# Altium project AlarmClock.PrjPcb
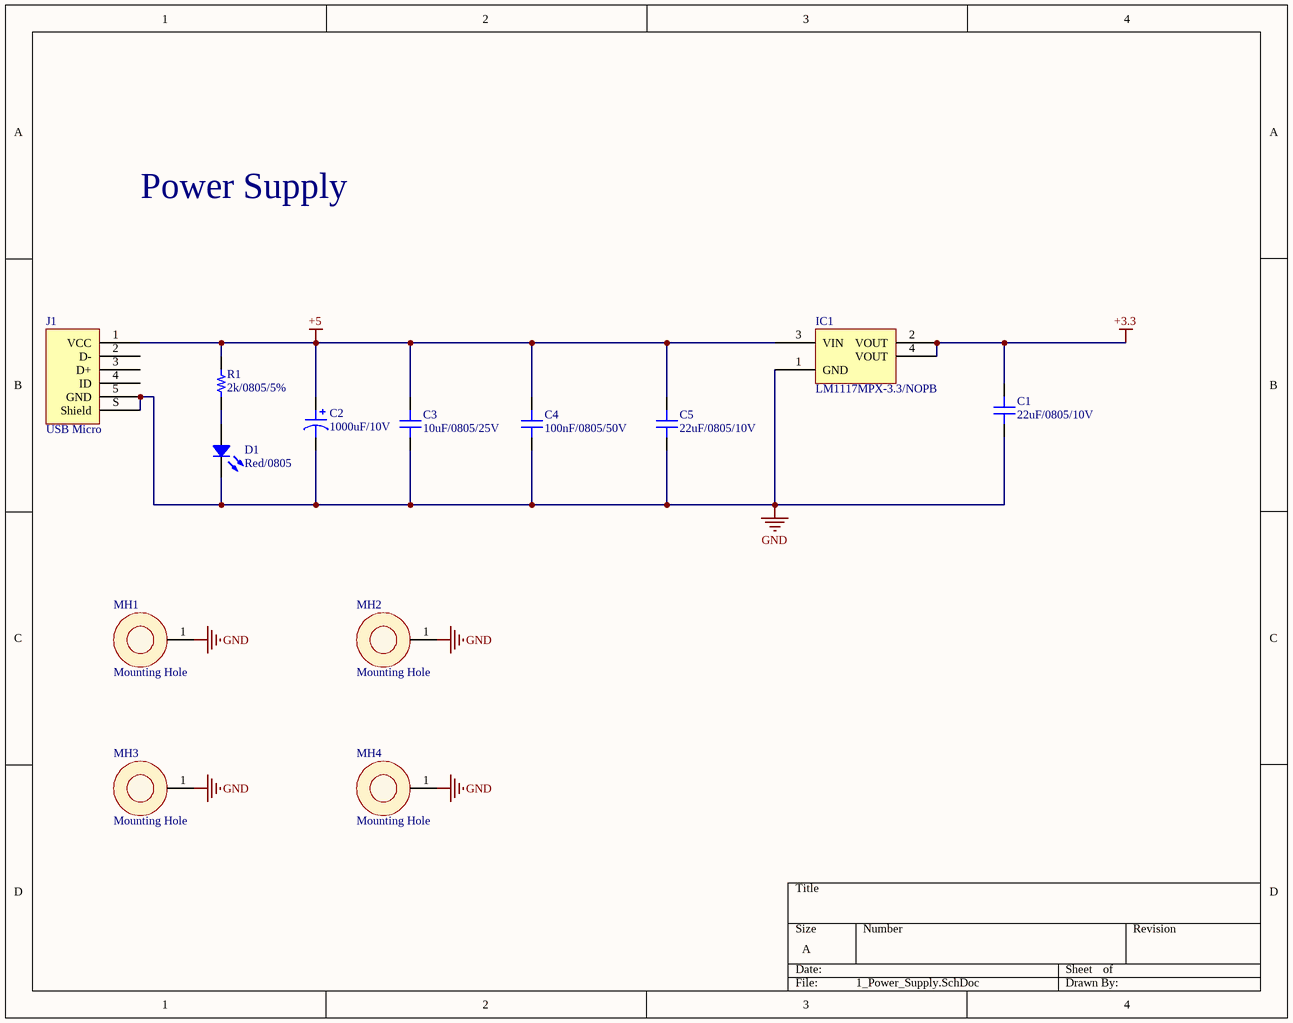
[diagram p0: 1_Power_Supply.SchDoc]
5 sheets, 80 parts. Net scope: flat (ports and power ports of the same name join across sheets).
Board file: PCB1.PcbDoc
Sheets:
  1_Power_Supply.SchDoc
  2_DS3231.SchDoc
  3_IO_Module.SchDoc
  4_MCU.SchDoc
  5_LCD.SchDoc

## Sheet 1_Power_Supply.SchDoc
size A; SheetNumber: 1; SheetTotal: 5

### Parts
C1  22uF/0805/10V  [CAP 0805_2012]
C2  1000uF/10V  [CAP ALSMD 4.3MM H5.4MM]
C3  10uF/0805/25V  [CAP FILM 0805]
C4  100nF/0805/50V  [CAP FILM 0805]
C5  22uF/0805/10V  [CAP 0805_2012]
D1  Red/0805  [LED 0805_2012 RED]
IC1  LM1117MPX-3.3/NOPB  [TI SOT-223 DCY]
J1  USB Micro  [FCI USB 10118193-0001LF]
MH1  Mounting Hole  [M3_Hole]  (no BOM)
MH2  Mounting Hole  [M3_Hole]  (no BOM)
MH3  Mounting Hole  [M3_Hole]  (no BOM)
MH4  Mounting Hole  [M3_Hole]  (no BOM)
R1  2k/0805/5%  [RES 0805_2012]

### Nets
+3.3: C1.1 IC1.2(VOUT) IC1.4(VOUT)
+5: C2.1 C3.2 C4.2 C5.1 IC1.3(VIN) J1.1(VCC) R1.2
GND: C1.2 C2.2 C3.1 C4.1 C5.2 D1.2 IC1.1(GND) J1.5(GND) J1.S(Shield) MH1.1(FG) MH2.1(FG) MH3.1(FG) MH4.1(FG)
NetD1_1: D1.1 R1.1

Not connected (* = marked no-connect by the designer): J1 2(D-) 3(D+) 4(ID)

### Notes on the sheet
- Power Supply

### Library data of the parts
C1 C5 = Capacitor - MLCC: Multilayer Ceramic Capacitor, 22 uF, 10 V, ± 20%, X5R, 0805 [2012 Metric]; Manufacturer: Samsung; Manufacturer Part Number: CL21A226MPQNNNE; Capacitance: 22uF; Voltage Rating: 10V; Supplier 1: Avnet; Supplier Part Number 1: CL21A226MPQNNNE; RoHS: Yes; Category: Ceramic Capacitors; Stock 1: 8000; Pricing 1: 2000=0.01584, 4000=0.01548, 8000=0.01511, 12000=0.01474, 16000=0.01438 (USD); Mount: Surface Mount; Case/Package: 0805; Case Code (Metric): 2012; Case Code (Imperial): 0805; Min Operating Temperature: -55°C; Max Operating Temperature: 85°C; Package Quantity: 1; Packaging: Cut Tape; Tolerance: 20%; Voltage Rating (DC): 10V; Series: CL; Length: 0.079inch; Width: 0.049inch; Thickness: 0.053inch; Lead Free: Lead Free; RoHS Compliant: Yes; ComponentLink1URL: https://datasheet.ciiva.com/25721/cl21a226mpqnnne-25721488.pdf?src-supplier=Digikey; ComponentLink1Description: https://datasheet.ciiva.com/25721/cl21a226mpqnnne-25721488.pdf?src-supplier=Digikey
C2 = Capacitor - Aluminum: Aluminum Electrolytic Capacitor, 1000 uF, 10 V, ± 20%, 1000 hours @ 105°C, Radial Can - SMD; Manufacturer: Panasonic; Manufacturer Part Number: EEE-HA1A102P; Supplier 1: Mouser; Supplier Part Number 1: 667-EEE-HA1A102P; RoHS: Yes; Category: Aluminum Electrolytic Capacitors; Stock 1: 370; Pricing 1: 1=0.63, 10=0.405, 50=0.405, 100=0.329, 1000=0.217, 10000=0.197 (USD); ComponentLink1URL: https://datasheet.ciiva.com/92/aba0000ce3-92032.pdf?src-supplier=Digikey; ComponentLink1Description: https://datasheet.ciiva.com/92/aba0000ce3-92032.pdf?src-supplier=Digikey; ComponentLink2URL: https://datasheet.ciiva.com/92/aba0000ce3-92033.pdf?src-supplier=Digikey; ComponentLink2Description: https://datasheet.ciiva.com/92/aba0000ce3-92033.pdf?src-supplier=Digikey; ComponentLink3URL: https://datasheet.ciiva.com/11777/0900766b8102e3f9-11777407.pdf?src-supplier=Rs; ComponentLink3Description: https://datasheet.ciiva.com/11777/0900766b8102e3f9-11777407.pdf?src-supplier=Rs; ComponentLink4URL: https://datasheet.ciiva.com/16433/aba0000ce3-16433432.pdf?src-supplier=Future+Electronics; ComponentLink4Description: https://datasheet.ciiva.com/16433/aba0000ce3-16433432.pdf?src-supplier=Future+Electronics; ComponentLink5URL: https://datasheet.ciiva.com/43459/1446029-43459814.pdf?src-supplier=Farnell; ComponentLink5Description: https://datasheet.ciiva.com/43459/1446029-43459814.pdf?src-supplier=Farnell; ComponentLink6URL: https://datasheet.ciiva.com/24228/aba0000ce3-259063-24228124.pdf?src-supplier=Mouser; ComponentLink6Description: https://datasheet.ciiva.com/24228/aba0000ce3-259063-24228124.pdf?src-supplier=Mouser; ComponentLink7URL: https://datasheet.ciiva.com/92/aba0000ce3-92031.pdf?src-supplier=Digikey; ComponentLink7Description: https://datasheet.ciiva.com/92/aba0000ce3-92031.pdf?src-supplier=Digikey; ComponentLink8URL: https://datasheet.ciiva.com/2985/aba0000ce3-2985629.pdf?src-supplier=Avnet; ComponentLink8Description: https://datasheet.ciiva.com/2985/aba0000ce3-2985629.pdf?src-supplier=Avnet; ComponentLink9URL: https://datasheet.ciiva.com/30100/33aba0000ce3-30100694.pdf?src-supplier=Onlinecomponents.com; ComponentLink9Description: https://datasheet.ciiva.com/30100/33aba0000ce3-30100694.pdf?src-supplier=Onlinecomponents.com; ComponentLink10URL: https://datasheet.ciiva.com/14597/70256712-14597160.pdf?src-supplier=Allied+Electronics; ComponentLink10Description: https://datasheet.ciiva.com/14597/70256712-14597160.pdf?src-supplier=Allied+Electronics; ComponentLink11URL: https://datasheet.ciiva.com/46386/1446029-46386671.pdf?src-supplier=Element14; ComponentLink11Description: https://datasheet.ciiva.com/46386/1446029-46386671.pdf?src-supplier=Element14; ComponentLink12URL: https://datasheet.ciiva.com/6012/1446029-6012554.pdf?src-supplier=Farnell; ComponentLink12Description: https://datasheet.ciiva.com/6012/1446029-6012554.pdf?src-supplier=Farnell; Value: 1000uF/10V
C3 = Capacitor - MLCC: Multilayer Ceramic Capacitor, 10 uF, 25 V, ï¿½ 10%, X5R, 0805 [2012 Metric]; Manufacturer: Samsung; Manufacturer Part Number: CL21A106KAYNNNE; Capacitance: 10uF; Voltage Rating: 25V; Supplier 1: Avnet; Supplier Part Number 1: CL21A106KAYNNNE; RoHS: Yes; Category: Ceramic Capacitors; Stock 1: 1478000; Pricing 1: 2000=0.00778 (USD); Mount: Surface Mount; Case/Package: 0805; Case Code (Metric): 2012; Case Code (Imperial): 0805; Material: Ceramic; Min Operating Temperature: -55°C; Max Operating Temperature: 85°C; Package Quantity: 1; Packaging: Tape and Reel; Tolerance: 10%; Dielectric: X5R; Series: CL; Construction: Flat; Voltage Rating (DC): 25V; Length: 2mm; Width: 0.049inch; Height: 1.25mm; Thickness: 0.057inch; Depth: 1.25mm; Radiation Hardening: No; RoHS Compliant: Yes; ComponentLink1URL: https://datasheet.ciiva.com/25796/cl21a106kaynnne-25796720.pdf?src-supplier=Digikey; ComponentLink1Description: https://datasheet.ciiva.com/25796/cl21a106kaynnne-25796720.pdf?src-supplier=Digikey; ComponentLink2URL: https://datasheet.ciiva.com/26838/getdatasheetpartid-357558-26838583.pdf?src-supplier=Verical; ComponentLink2Description: https://datasheet.ciiva.com/26838/getdatasheetpartid-357558-26838583.pdf?src-supplier=Verical
C4 = Capacitor - MLCC: Multilayer Ceramic Capacitor, 0.1 uF, 50 V, ï¿½ 10%, X7R, 0805 [2012 Metric]; Manufacturer: Samsung; Manufacturer Part Number: CL21B104KBCNNNC; Capacitance: 100nF; Voltage Rating: 50V; Supplier 1: Avnet; Supplier Part Number 1: CL21B104KBCNNNC; RoHS: Yes; Category: Ceramic Capacitors; Stock 1: 850000; Pricing 1: 4000=0.0097, 8000=0.00455, 16000=0.00444, 24000=0.00434, 32000=0.00423 (USD); Mount: Surface Mount; Case/Package: 0805; Case Code (Metric): 2012; Case Code (Imperial): 0805; Material: Ceramic; Min Operating Temperature: -55°C; Max Operating Temperature: 125°C; Tolerance: 10%; Dielectric: X7R; Packaging: Tape and Reel; Voltage: 50V; Series: CL; Construction: Flat; Voltage Rating (DC): 50V; Length: 2mm; Width: 0.049inch; Height: 0.85mm; Depth: 1.25mm; Thickness: 0.037inch; Radiation Hardening: No; RoHS Compliant: Yes; Lead Free: 5697LeadFree; ComponentLink1URL: https://datasheet.ciiva.com/25710/cl21b104kbcnnnc-25710182.pdf?src-supplier=Digikey; ComponentLink1Description: https://datasheet.ciiva.com/25710/cl21b104kbcnnnc-25710182.pdf?src-supplier=Digikey; ComponentLink2URL: https://datasheet.ciiva.com/29199/454152-da-01-en-vs-kondensator-0805-29199814.pdf?src-supplier=Conrad; ComponentLink2Description: https://datasheet.ciiva.com/29199/454152-da-01-en-vs-kondensator-0805-29199814.pdf?src-supplier=Conrad
D1 = LED: LED Uni-Color Red 2-Pin Chip 0805(2012Metric) T/R; Manufacturer: Rohm; Manufacturer Part Number: SML-H12U8TT86; Supplier 1: Mouser; Supplier Part Number 1: 755-SML-H12U8TT86; RoHS: Yes; Category: LEDs; Stock 1: 208; Pricing 1: 1=0.66, 10=0.393, 50=0.393, 100=0.204, 1000=0.185, 10000=0.157 (USD); ComponentLink1URL: http://www.mouser.com/ds/2/348/sml-h1-313836.pdf?src-supplier=Mouser; ComponentLink1Description: http://www.mouser.com/ds/2/348/sml-h1-313836.pdf?src-supplier=Mouser; ComponentLink2URL: http://www.farnell.com/datasheets/2292365.pdf?src-supplier=Farnell; ComponentLink2Description: http://www.farnell.com/datasheets/2292365.pdf?src-supplier=Farnell; ComponentLink3URL: https://datasheet.octopart.com/SML-H12U8TT86-Rohm-datasheet-61210011.pdf?src-supplier=Element14; ComponentLink3Description: https://datasheet.octopart.com/SML-H12U8TT86-Rohm-datasheet-61210011.pdf?src-supplier=Element14; ComponentLink4URL: https://www.rohm.com/datasheet/SML-H12M8T?src-supplier=Digikey; ComponentLink4Description: https://www.rohm.com/datasheet/SML-H12M8T?src-supplier=Digikey; ComponentLink5URL: https://datasheet.octopart.com/SML-H12U8TT86-Rohm-datasheet-68298519.pdf?src-supplier=Future+Electronics; ComponentLink5Description: https://datasheet.octopart.com/SML-H12U8TT86-Rohm-datasheet-68298519.pdf?src-supplier=Future+Electronics; ComponentLink6URL: https://datasheet.octopart.com/SML-H12U8TT86-Rohm-datasheet-142144718.pdf?src-supplier=TME; ComponentLink6Description: https://datasheet.octopart.com/SML-H12U8TT86-Rohm-datasheet-142144718.pdf?src-supplier=TME; Value: Red/0805
IC1 = LM1117IMP/NOPB: 800-mA 15-V linear voltage regulator ; 4-SOT-223 0 to 125; Manufacturer: Texas Instruments; Number of Channels: 1NUMBER; Min Current Limit: 800mA; Supplier 1: Mouser; Supplier Part Number 1: 926-LM1117MPX3.3NOPB; Manufacturer Part Number: LM1117MPX-3.3/NOPB; RoHS: Yes; Category: Voltage Regulators - Linear; Stock 1: 40334; Pricing 1: 1=0.99, 10=0.65, 50=0.65, 100=0.529, 1000=0.49, 10000=0.452 (USD); Thickness: 1.6mm; Radiation Hardening: 5898YesNo; Lead Free: 5697LeadFree
J1 = USB 2.0 Type B Micro
R1 = Resistor: Res Thin Film 0805 2K Ohm 0.1% 0.125W(1/8W) ±25ppm/C Pad SMD T/R; Manufacturer: Yageo; Manufacturer Part Number: RT0805BRD072KL; Voltage Rating (DC): 150V; Tolerance: 5%; Supplier 1: Future Electronics; Supplier Part Number 1: 9309717; RoHS: Yes; Category: Chip SMD Resistors; Stock 1: 35000; Pricing 1: 5000=0.0215, 15000=0.0207, 25000=0.0203, 75000=0.0196, 125000=0.019 (USD); Lead Free: 5697LeadFree; ComponentLink1URL: https://datasheet.ciiva.com/12836/pyu-rt-1-to-0-05-rohs-l-4-12836431.pdf?src-supplier=Mouser; ComponentLink1Description: https://datasheet.ciiva.com/12836/pyu-rt-1-to-0-05-rohs-l-4-12836431.pdf?src-supplier=Mouser; ComponentLink2URL: https://datasheet.ciiva.com/8894/pyu-rt-1-to-0-05-rohs-l-4-8894822.pdf?src-supplier=Avnet; ComponentLink2Description: https://datasheet.ciiva.com/8894/pyu-rt-1-to-0-05-rohs-l-4-8894822.pdf?src-supplier=Avnet; ComponentLink3URL: https://datasheet.ciiva.com/2584/pyu-rt-1-to-0-05-rohs-l-4-2584929.pdf?src-supplier=Digikey; ComponentLink3Description: https://datasheet.ciiva.com/2584/pyu-rt-1-to-0-05-rohs-l-4-2584929.pdf?src-supplier=Digikey; ComponentLink4URL: https://datasheet.ciiva.com/46634/pyu-rt-1-to-0-05-rohs-l-5-46634903.pdf?src-supplier=Digikey; ComponentLink4Description: https://datasheet.ciiva.com/46634/pyu-rt-1-to-0-05-rohs-l-5-46634903.pdf?src-supplier=Digikey; Resistance: 2k; Case/Package: 0805

## Sheet 2_DS3231.SchDoc
size A; SheetNumber: 2; SheetTotal: 5
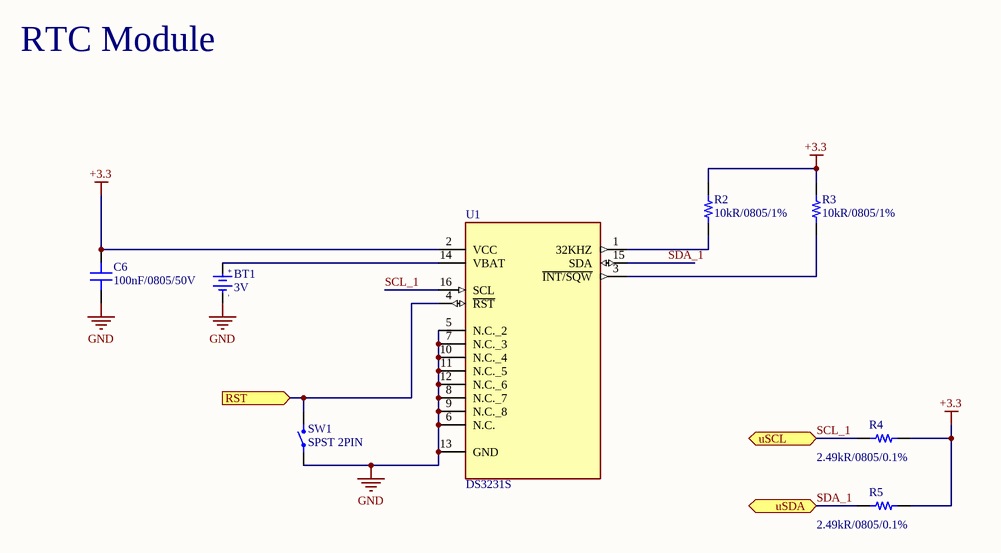
[diagram p1: 2_DS3231.SchDoc]

### Parts
BT1  3V  [PIN3V]
C6  100nF/0805/50V  [CAP FILM 0805]
R2  10kR/0805/1%  [RES 0805_2012]
R3  10kR/0805/1%  [RES 0805_2012]
R4  2.49kR/0805/0.1%  [RES 0805_2012]
R5  2.49kR/0805/0.1%  [RES 0805_2012]
SW1  SPST 2PIN  [3x4 SPST BUTTON]
U1  DS3231S  [SOIC127P1032X265-16N]

### Ports
RST (in), uSCL (bidir), uSDA (bidir)

### Nets
+3.3: C6.2 R2.2 R3.2 R4.1 R5.1 U1.2(VCC)
GND: BT1.2(GND) C6.1 SW1.1 U1.5(N.C._2) U1.6(N.C.) U1.7(N.C._3) U1.8(N.C._7) U1.9(N.C._8) U1.10(N.C._4) U1.11(N.C._5) U1.12(N.C._6) U1.13(GND)
SCL_1: R4.2 U1.16(SCL) ; port uSCL  [project net SCL]
SDA_1: R5.2 U1.15(SDA) ; port uSDA
NetBT1_1: BT1.1(+3V) U1.14(VBAT)
NetR2_1: R2.1 U1.1(32KHZ)
NetR3_1: R3.1 U1.3(~{INT/SQW})
NetSW1_2: SW1.2 U1.4(~{RST}) ; port RST

### Notes on the sheet
- RTC Module
- (in symbol PIN 3V) +; -

### Library data of the parts
BT1 = PIN 3V: Battery 3VDC; Value: PIN 3V
C6 = Capacitor - MLCC: as C4 on sheet 1_Power_Supply; Supplier 1: Avnet; Supplier Part Number 1: CL21B104KBCNNNC; RoHS: Yes; Category: Ceramic Capacitors; Stock 1: 850000; Pricing 1: 4000=0.0097, 8000=0.00455, 16000=0.00444, 24000=0.00434, 32000=0.00423 (USD); Mount: Surface Mount; Case/Package: 0805; Case Code (Metric): 2012; Case Code (Imperial): 0805; Material: Ceramic; Min Operating Temperature: -55°C; Max Operating Temperature: 125°C; Tolerance: 10%; Dielectric: X7R; Packaging: Tape and Reel; Voltage: 50V; Series: CL; Construction: Flat; Voltage Rating (DC): 50V; Length: 2mm; Width: 0.049inch; Height: 0.85mm; Depth: 1.25mm; Thickness: 0.037inch; Radiation Hardening: No; RoHS Compliant: Yes; Lead Free: 5697LeadFree; ComponentLink1URL: https://datasheet.ciiva.com/25710/cl21b104kbcnnnc-25710182.pdf?src-supplier=Digikey; ComponentLink1Description: https://datasheet.ciiva.com/25710/cl21b104kbcnnnc-25710182.pdf?src-supplier=Digikey; ComponentLink2URL: https://datasheet.ciiva.com/29199/454152-da-01-en-vs-kondensator-0805-29199814.pdf?src-supplier=Conrad; ComponentLink2Description: https://datasheet.ciiva.com/29199/454152-da-01-en-vs-kondensator-0805-29199814.pdf?src-supplier=Conrad
R2 R3 = Resistor: SMD Chip Resistor, 10 kOhm, ï¿½ 1%, 125 mW, 0805 [2012 Metric], Thick Film, General Purpose; Manufacturer: Yageo; Manufacturer Part Number: RC0805FR-0710KL; Resistance: 10kR; Temperature Coefficient: 100ppm/°C; Power Rating: 125mW; Voltage Rating: 150V; Supplier 1: Future Electronics; Supplier Part Number 1: 3310877; RoHS: Yes; Category: Chip SMD Resistors; Stock 1: 3290000; Pricing 1: 5000=0.0035, 25000=0.0034, 100000=0.0032, 250000=0.0032, 625000=0.003 (USD); Case/Package: 0805; Case Code (Imperial): 0805; Case Code (Metric): 2012; Size Code: 0805; Min Operating Temperature: -55°C; Max Operating Temperature: 155°C; Tolerance: 1%; Packaging: Tape and Reel; Resistor Type: Thick Film; Package Quantity: 1; Termination: SMD/SMT; Number of Terminations: 2; Max Power Dissipation: 125mW; Features: Moisture Resistant; Series: RC; Construction: Rectangular; Resistance Tolerance: 1%; Technology: THICK FILM; Length: 0.079inch; Width: 0.049inch; Height: 0.024inch; Depth: 1.25mm; Reach SVHC Compliant: Unknown; Lead Free: Lead Free; Military Standard: Not; RoHS Compliant: Yes
R4 R5 = Resistor: SMD Chip Resistor, High Precision, 2.49 kohm, ± 0.1%, 250 mW, 0805 [2012 Metric], Thick Film; Manufacturer: Panasonic; Manufacturer Part Number: ERJ-PB6B2491V; Resistance: 2.49kR; Max Power Dissipation: 250mW; Temperature Coefficient: 50ppm/°C; Voltage Rating (DC): 150V; Supplier 1: Mouser; Supplier Part Number 1: 667-ERJ-PB6B2491V; RoHS: Yes; Category: Chip SMD Resistors; Stock 1: 6524; Pricing 1: 1=0.36, 10=0.163, 50=0.163, 100=0.073, 1000=0.051, 10000=0.039 (USD); Case/Package: 0805; Case Code (Metric): 2012; Case Code (Imperial): 0805; Min Operating Temperature: -55°C; Max Operating Temperature: 155°C; Packaging: Cut Tape; Number of Terminations: 2; Tolerance: 0.1%; Features: Automotive AEC-Q200; Series: ERJ; Length: 0.079inch; Width: 0.049inch; Height - Seated (Max): 0.028inch; ComponentLink1URL: https://industrial.panasonic.com/cdbs/www-data/pdf/RDM0000/DMM0000COL5.pdf?src-supplier=Digikey; ComponentLink1Description: https://industrial.panasonic.com/cdbs/www-data/pdf/RDM0000/DMM0000COL5.pdf?src-supplier=Digikey; ComponentLink2URL: https://industrial.panasonic.com/cdbs/www-data/pdf/RDM0000/AOA0000C328.pdf?src-supplier=Digikey; ComponentLink2Description: https://industrial.panasonic.com/cdbs/www-data/pdf/RDM0000/AOA0000C328.pdf?src-supplier=Digikey
U1 = DS3231S: Real Time Clock (RTC) IC Clock/Calendar - IÂ²C, 2-Wire Serial 16-SOIC (0.295, 7.50mm Width); MF: Maxim Integrated; MP: DS3231S#; Value: *; Price: None; Package: SOIC-16 Maxim; Check_prices: https://www.snapeda.com/parts/DS3231S%23/Maxim+Integrated/view-part/?ref=eda; Availability: In Stock; SnapEDA_Link: https://www.snapeda.com/parts/DS3231S%23/Maxim+Integrated/view-part/?ref=snap; Purchase-URL: https://pricing.snapeda.com/search/part/DS3231S#/?ref=eda

## Sheet 3_IO_Module.SchDoc
size A; SheetNumber: 3; SheetTotal: 5
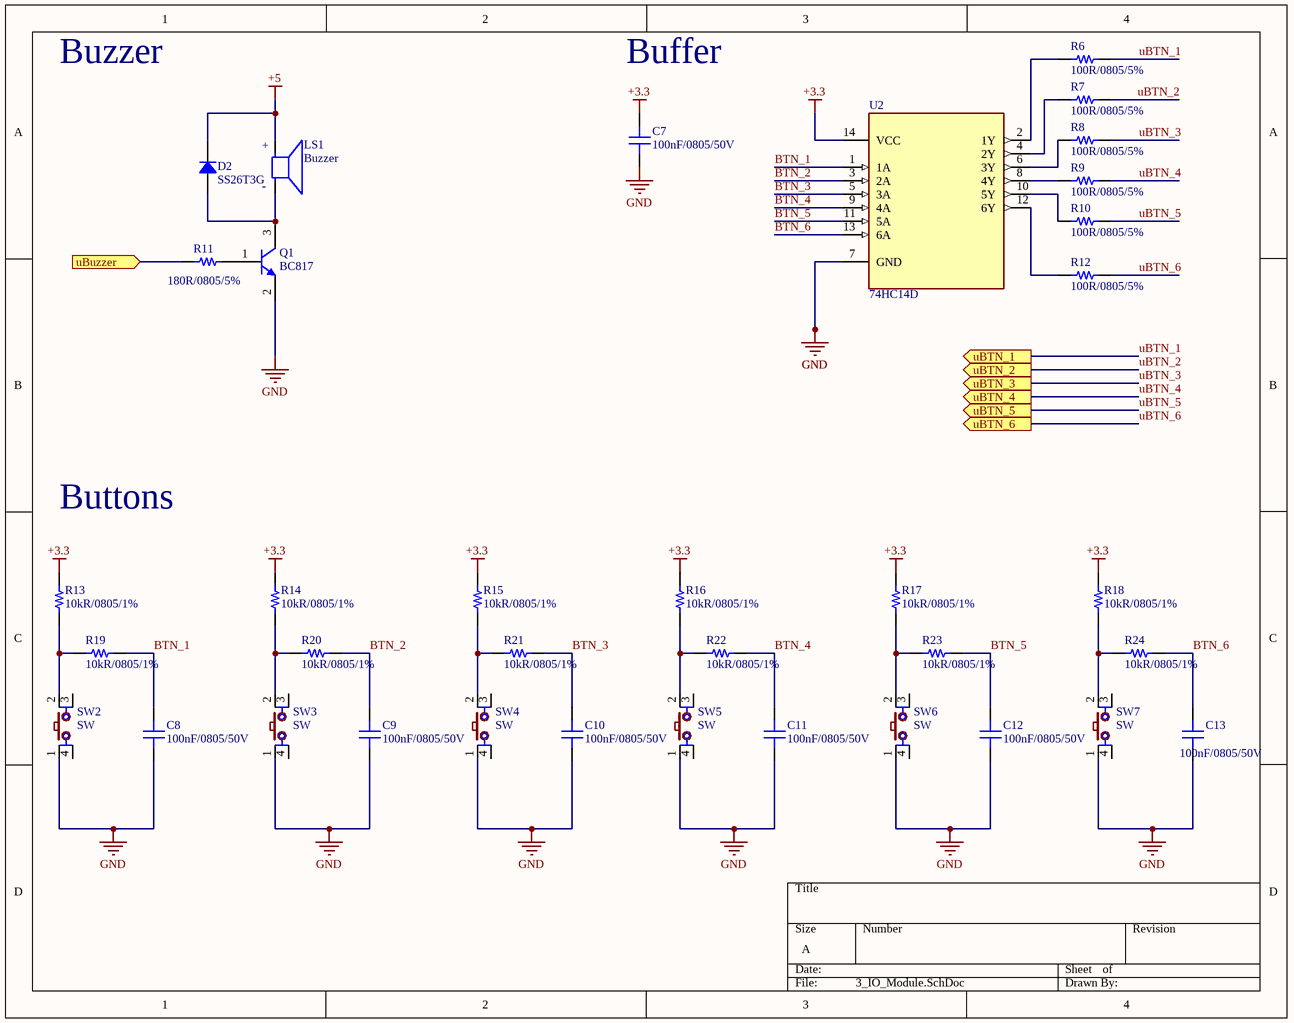
[diagram p2: 3_IO_Module.SchDoc]

### Parts
C7  100nF/0805/50V  [CAP FILM 0805]
C8  100nF/0805/50V  [CAP FILM 0805]
C9  100nF/0805/50V  [CAP FILM 0805]
C10  100nF/0805/50V  [CAP FILM 0805]
C11  100nF/0805/50V  [CAP FILM 0805]
C12  100nF/0805/50V  [CAP FILM 0805]
C13  100nF/0805/50V  [CAP FILM 0805]
D2  SS26T3G  [ST DO214AC SMA]
LS1  Buzzer  [XDCR_AT-1224-TWT-5V-2-R]
Q1  BC817  [TI SOT-23-3 DBZ]
R6  100R/0805/5%  [RES 0805_2012]
R7  100R/0805/5%  [RES 0805_2012]
R8  100R/0805/5%  [RES 0805_2012]
R9  100R/0805/5%  [RES 0805_2012]
R10  100R/0805/5%  [RES 0805_2012]
R11  180R/0805/5%  [RES 0805_2012]
R12  100R/0805/5%  [RES 0805_2012]
R13  10kR/0805/1%  [RES 0805_2012]
R14  10kR/0805/1%  [RES 0805_2012]
R15  10kR/0805/1%  [RES 0805_2012]
R16  10kR/0805/1%  [RES 0805_2012]
R17  10kR/0805/1%  [RES 0805_2012]
R18  10kR/0805/1%  [RES 0805_2012]
R19  10kR/0805/1%  [RES 0805_2012]
R20  10kR/0805/1%  [RES 0805_2012]
R21  10kR/0805/1%  [RES 0805_2012]
R22  10kR/0805/1%  [RES 0805_2012]
R23  10kR/0805/1%  [RES 0805_2012]
R24  10kR/0805/1%  [RES 0805_2012]
SW2  SW  [SW2-SMD]
SW3  SW  [SW2-SMD]
SW4  SW  [SW2-SMD]
SW5  SW  [SW2-SMD]
SW6  SW  [SW2-SMD]
SW7  SW  [SW2-SMD]
U2  74HC14D  [SOIC127P600X175-14N]

### Ports
uBTN_1 (out), uBTN_2 (out), uBTN_3 (out), uBTN_4 (out), uBTN_5 (out), uBTN_6 (out), uBuzzer (in)

### Nets
+3.3: C7.2 R13.2 R14.2 R15.2 R16.2 R17.2 R18.2 U2.14(VCC)
+5: D2.2 LS1.P
GND: C7.1 C8.1 C9.1 C10.1 C11.1 C12.1 C13.1 Q1.2(E) SW2.1 SW3.1 SW4.1 SW5.1 SW6.1 SW7.1 U2.7(GND)
BTN_1: C8.2 R19.1 U2.1(1A)
BTN_2: C9.2 R20.1 U2.3(2A)
BTN_3: C10.2 R21.1 U2.5(3A)
BTN_4: C11.2 R22.1 U2.9(4A)
BTN_5: C12.2 R23.1 U2.11(5A)
BTN_6: C13.2 R24.1 U2.13(6A)
uBTN_1: R6.2 ; port uBTN_1
uBTN_2: R7.2 ; port uBTN_2
uBTN_3: R8.2 ; port uBTN_3
uBTN_4: R9.2 ; port uBTN_4
uBTN_5: R10.2 ; port uBTN_5
uBTN_6: R12.2 ; port uBTN_6
uBuzzer: R11.2 ; port uBuzzer
NetD2_1: D2.1 LS1.N Q1.3(C)
NetQ1_1: Q1.1(B) R11.1
NetR6_1: R6.1 U2.2(1Y)
NetR7_1: R7.1 U2.4(2Y)
NetR8_1: R8.1 U2.6(3Y)
NetR9_1: R9.1 U2.8(4Y)
NetR10_1: R10.1 U2.10(5Y)
NetR12_1: R12.1 U2.12(6Y)
NetR13_1: R13.1 R19.2 SW2.2
NetR14_1: R14.1 R20.2 SW3.2
NetR15_1: R15.1 R21.2 SW4.2
NetR16_1: R16.1 R22.2 SW5.2
NetR17_1: R17.1 R23.2 SW6.2
NetR18_1: R18.1 R24.2 SW7.2

Not connected (* = marked no-connect by the designer): SW2 3 4; SW3 3 4; SW4 3 4; SW5 3 4; SW6 3 4; SW7 3 4

### Notes on the sheet
- Buzzer
- Buffer
- Buttons
- (in symbol AT-1224-TWT-5V-2-R) +; -

### Library data of the parts
C7-C13 = Capacitor - MLCC: as C4 on sheet 1_Power_Supply; Supplier 1: Avnet; Supplier Part Number 1: CL21B104KBCNNNC; RoHS: Yes; Category: Ceramic Capacitors; Stock 1: 850000; Pricing 1: 4000=0.0097, 8000=0.00455, 16000=0.00444, 24000=0.00434, 32000=0.00423 (USD); Mount: Surface Mount; Case/Package: 0805; Case Code (Metric): 2012; Case Code (Imperial): 0805; Material: Ceramic; Min Operating Temperature: -55°C; Max Operating Temperature: 125°C; Tolerance: 10%; Dielectric: X7R; Packaging: Tape and Reel; Voltage: 50V; Series: CL; Construction: Flat; Voltage Rating (DC): 50V; Length: 2mm; Width: 0.049inch; Height: 0.85mm; Depth: 1.25mm; Thickness: 0.037inch; Radiation Hardening: No; RoHS Compliant: Yes; Lead Free: 5697LeadFree; ComponentLink1URL: https://datasheet.ciiva.com/25710/cl21b104kbcnnnc-25710182.pdf?src-supplier=Digikey; ComponentLink1Description: https://datasheet.ciiva.com/25710/cl21b104kbcnnnc-25710182.pdf?src-supplier=Digikey; ComponentLink2URL: https://datasheet.ciiva.com/29199/454152-da-01-en-vs-kondensator-0805-29199814.pdf?src-supplier=Conrad; ComponentLink2Description: https://datasheet.ciiva.com/29199/454152-da-01-en-vs-kondensator-0805-29199814.pdf?src-supplier=Conrad
D2 = Diode: VR=60V IF=2A; Manufacturer: ON Semiconductor; Supplier 1: Future Electronics; Supplier Part Number 1: 2177327; Manufacturer Part Number: SS26T3G; RoHS: Yes; Category: Schottky Diodes; Stock 1: 680000; Pricing 1: 2500=0.0916, 5000=0.0892, 7500=0.0878, 12500=0.0861, 25000=0.0826 (USD); ComponentLink1URL: https://datasheet.ciiva.com/915/ss26-d-915744.pdf?src-supplier=Avnet; ComponentLink1Description: https://datasheet.ciiva.com/915/ss26-d-915744.pdf?src-supplier=Avnet; ComponentLink2URL: https://datasheet.ciiva.com/915/ss26-d-915744.pdf?src-supplier=Digikey; ComponentLink2Description: https://datasheet.ciiva.com/915/ss26-d-915744.pdf?src-supplier=Digikey; ComponentLink3URL: https://datasheet.ciiva.com/4715/ss26-d-116950-4715414.pdf?src-supplier=Mouser; ComponentLink3Description: https://datasheet.ciiva.com/4715/ss26-d-116950-4715414.pdf?src-supplier=Mouser; ComponentLink4URL: https://datasheet.ciiva.com/30479/0900766b811a65f7-30479444.pdf?src-supplier=Rs; ComponentLink4Description: https://datasheet.ciiva.com/30479/0900766b811a65f7-30479444.pdf?src-supplier=Rs; ComponentLink5URL: https://datasheet.ciiva.com/8292/ss26-d-8292426.pdf?src-supplier=Avnet; ComponentLink5Description: https://datasheet.ciiva.com/8292/ss26-d-8292426.pdf?src-supplier=Avnet; ComponentLink6URL: https://datasheet.ciiva.com/915/ss26-d-915745.pdf?src-supplier=Digikey; ComponentLink6Description: https://datasheet.ciiva.com/915/ss26-d-915745.pdf?src-supplier=Digikey; ComponentLink7URL: https://datasheet.ciiva.com/17011/70275469-17011591.pdf?src-supplier=Allied+Electronics; ComponentLink7Description: https://datasheet.ciiva.com/17011/70275469-17011591.pdf?src-supplier=Allied+Electronics; ComponentLink8URL: https://datasheet.ciiva.com/16206/ss26-d-16206477.pdf?src-supplier=Future+Electronics; ComponentLink8Description: https://datasheet.ciiva.com/16206/ss26-d-16206477.pdf?src-supplier=Future+Electronics
LS1 = AT-1224-TWT-5V-2-R: AUDIO TRANSDUCER 12 VP-P 85 DB 2400 HZ; Package: None; Price: None; Value: *; MP: AT-1224-TWT-5V-2-R; Availability: Unavailable
Q1 = BJT NPN
R6-R10 R12 = Resistor: SMD Chip Resistor, 100 Ohm, ± 5%, 125 mW, 0805 [2012 Metric], Thick Film, General Purpose; Manufacturer: Yageo; Manufacturer Part Number: AC0805JR-07100RL; Resistance: 100R; Supplier 1: Future Electronics; Supplier Part Number 1: 4083153; RoHS: Yes; Category: Chip SMD Resistors; Stock 1: 295000; Pricing 1: 5000=0.004, 25000=0.0038, 100000=0.0037, 250000=0.0036, 625000=0.0034 (USD); ComponentLink1URL: http://www.mouser.com/ds/2/447/yageodocoutput-1111992.pdf?src-supplier=Mouser; ComponentLink1Description: http://www.mouser.com/ds/2/447/yageodocoutput-1111992.pdf?src-supplier=Mouser; ComponentLink2URL: https://www.yageo.com/upload/media/product/productsearch/datasheet/rchip/PYu-AC_51_RoHS_L_7.pdf?src-supplier=Digikey; ComponentLink2Description: https://www.yageo.com/upload/media/product/productsearch/datasheet/rchip/PYu-AC_51_RoHS_L_7.pdf?src-supplier=Digikey; ComponentLink3URL: http://www.yageo.com/NewPortal/yageodocoutput?fileName=/pdf/R-Chip/PYu-AC_51_RoHS_L_6.pdf&src-supplier=Digikey; ComponentLink3Description: http://www.yageo.com/NewPortal/yageodocoutput?fileName=/pdf/R-Chip/PYu-AC_51_RoHS_L_6.pdf&src-supplier=Digikey; ComponentLink4URL: https://datasheet.octopart.com/AC0805JR-07100RL-Yageo-datasheet-151884373.pdf?src-supplier=Future+Electronics; ComponentLink4Description: https://datasheet.octopart.com/AC0805JR-07100RL-Yageo-datasheet-151884373.pdf?src-supplier=Future+Electronics; Case/Package: 0805; Tolerance: 5%
R11 = Resistor: Anti-Sulfurated Chip Resistor Thick Film 0805 180Ohm 1% Paper T/R; Manufacturer: Yageo; Manufacturer Part Number: AF0805FR-07180RL; Power Rating: 125mW; Resistance: 180R; Temperature Coefficient: 100ppm/°C; Voltage Rating: 150V; Tolerance: 5%; Supplier 1: Digikey; Supplier Part Number 1: 13-AF0805FR-07180RL-ND; RoHS: Yes; Category: Chip SMD Resistors; Pricing 1: 5000=0.0153 (USD); Case/Package: 0805; Min Operating Temperature: -55°C; Max Operating Temperature: 155°C; Packaging: 10Packaging; Height: 600um
R13-R24 = Resistor: as R2 on sheet 2_DS3231; Supplier 1: Future Electronics; Supplier Part Number 1: 3310877; RoHS: Yes; Category: Chip SMD Resistors; Stock 1: 3290000; Pricing 1: 5000=0.0035, 25000=0.0034, 100000=0.0032, 250000=0.0032, 625000=0.003 (USD); Case/Package: 0805; Case Code (Imperial): 0805; Case Code (Metric): 2012; Size Code: 0805; Min Operating Temperature: -55°C; Max Operating Temperature: 155°C; Tolerance: 1%; Packaging: Tape and Reel; Resistor Type: Thick Film; Package Quantity: 1; Termination: SMD/SMT; Number of Terminations: 2; Max Power Dissipation: 125mW; Features: Moisture Resistant; Series: RC; Construction: Rectangular; Resistance Tolerance: 1%; Technology: THICK FILM; Length: 0.079inch; Width: 0.049inch; Height: 0.024inch; Depth: 1.25mm; Reach SVHC Compliant: Unknown; Lead Free: Lead Free; Military Standard: Not; RoHS Compliant: Yes
SW2-SW7 = SW4: Switch button 4 pin; Value: Button chip 4 pin
U2 = 74HC14D: Inverter IC 6 Channel Schmitt Trigger 14-SOIC; MF: Toshiba; SnapEDA_Link: https://www.snapeda.com/parts/74HC14D/Toshiba+Semiconductor+and+Storage/view-part/?ref=snap; Availability: In Stock; Price: None; Package: SO14-14 Nexperia USA Inc.; Purchase-URL: https://pricing.snapeda.com/search/part/74HC14D/?ref=eda; Check_prices: https://www.snapeda.com/parts/74HC14D/Toshiba+Semiconductor+and+Storage/view-part/?ref=eda; Value: *; MP: 74HC14D

## Sheet 4_MCU.SchDoc
size A; SheetNumber: 4; SheetTotal: 5
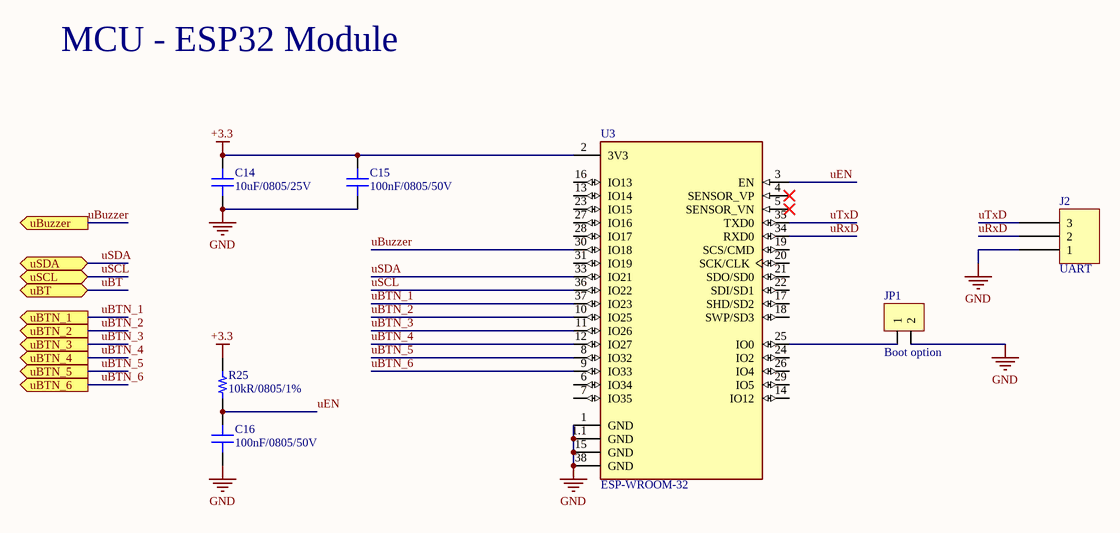
[diagram p3: 4_MCU.SchDoc]

### Parts
C14  10uF/0805/25V  [CAP FILM 0805]
C15  100nF/0805/50V  [CAP FILM 0805]
C16  100nF/0805/50V  [CAP FILM 0805]
J2  UART  [JST B3B-PH-K]
JP1  Boot option  [JP2-CLOSED]
R25  10kR/0805/1%  [RES 0805_2012]
U3  ESP-WROOM-32  [MODULE_ESP-WROOM-32]

### Ports
uBT (bidir), uBTN_1 (out), uBTN_2 (out), uBTN_3 (out), uBTN_4 (out), uBTN_5 (out), uBTN_6 (out), uBuzzer (out), uSCL (bidir), uSDA (bidir)

### Nets
+3.3: C14.2 C15.2 R25.2 U3.2(3V3)
GND: C14.1 C15.1 C16.1 J2.1 JP1.2 U3.1(GND) U3.1.1(GND) U3.15(GND) U3.38(GND)
uBT: port uBT
uBTN_1: U3.37(IO23) ; port uBTN_1
uBTN_2: U3.10(IO25) ; port uBTN_2
uBTN_3: U3.11(IO26) ; port uBTN_3
uBTN_4: U3.12(IO27) ; port uBTN_4
uBTN_5: U3.8(IO32) ; port uBTN_5
uBTN_6: U3.9(IO33) ; port uBTN_6
uBuzzer: U3.30(IO18) ; port uBuzzer
uEN: C16.2 R25.1 U3.3(EN)
uRxD: J2.2 U3.34(RXD0)
uSCL: U3.36(IO22) ; port uSCL  [project net SCL]
uSDA: U3.33(IO21) ; port uSDA  [project net SDA_1]
uTxD: J2.3 U3.35(TXD0)
NetJP1_1: JP1.1 U3.25(IO0)

Not connected (* = marked no-connect by the designer): U3 4(SENSOR_VP)* 5(SENSOR_VN)* 6(IO34) 7(IO35) 13(IO14) 14(IO12) 16(IO13) 17(SHD/SD2) 18(SWP/SD3) 19(SCS/CMD) 20(SCK/CLK) 21(SDO/SD0) 22(SDI/SD1) 23(IO15) 24(IO2) 26(IO4) 27(IO16) 28(IO17) 29(IO5) 31(IO19)

### Notes on the sheet
- MCU - ESP32 Module

### Library data of the parts
C14 = Capacitor - MLCC: as C3 on sheet 1_Power_Supply; Supplier 1: Avnet; Supplier Part Number 1: CL21A106KAYNNNE; RoHS: Yes; Category: Ceramic Capacitors; Stock 1: 1478000; Pricing 1: 2000=0.00778 (USD); Mount: Surface Mount; Case/Package: 0805; Case Code (Metric): 2012; Case Code (Imperial): 0805; Material: Ceramic; Min Operating Temperature: -55°C; Max Operating Temperature: 85°C; Package Quantity: 1; Packaging: Tape and Reel; Tolerance: 10%; Dielectric: X5R; Series: CL; Construction: Flat; Voltage Rating (DC): 25V; Length: 2mm; Width: 0.049inch; Height: 1.25mm; Thickness: 0.057inch; Depth: 1.25mm; Radiation Hardening: No; RoHS Compliant: Yes; ComponentLink1URL: https://datasheet.ciiva.com/25796/cl21a106kaynnne-25796720.pdf?src-supplier=Digikey; ComponentLink1Description: https://datasheet.ciiva.com/25796/cl21a106kaynnne-25796720.pdf?src-supplier=Digikey; ComponentLink2URL: https://datasheet.ciiva.com/26838/getdatasheetpartid-357558-26838583.pdf?src-supplier=Verical; ComponentLink2Description: https://datasheet.ciiva.com/26838/getdatasheetpartid-357558-26838583.pdf?src-supplier=Verical
C15 C16 = Capacitor - MLCC: as C4 on sheet 1_Power_Supply; Supplier 1: Avnet; Supplier Part Number 1: CL21B104KBCNNNC; RoHS: Yes; Category: Ceramic Capacitors; Stock 1: 850000; Pricing 1: 4000=0.0097, 8000=0.00455, 16000=0.00444, 24000=0.00434, 32000=0.00423 (USD); Mount: Surface Mount; Case/Package: 0805; Case Code (Metric): 2012; Case Code (Imperial): 0805; Material: Ceramic; Min Operating Temperature: -55°C; Max Operating Temperature: 125°C; Tolerance: 10%; Dielectric: X7R; Packaging: Tape and Reel; Voltage: 50V; Series: CL; Construction: Flat; Voltage Rating (DC): 50V; Length: 2mm; Width: 0.049inch; Height: 0.85mm; Depth: 1.25mm; Thickness: 0.037inch; Radiation Hardening: No; RoHS Compliant: Yes; Lead Free: 5697LeadFree; ComponentLink1URL: https://datasheet.ciiva.com/25710/cl21b104kbcnnnc-25710182.pdf?src-supplier=Digikey; ComponentLink1Description: https://datasheet.ciiva.com/25710/cl21b104kbcnnnc-25710182.pdf?src-supplier=Digikey; ComponentLink2URL: https://datasheet.ciiva.com/29199/454152-da-01-en-vs-kondensator-0805-29199814.pdf?src-supplier=Conrad; ComponentLink2Description: https://datasheet.ciiva.com/29199/454152-da-01-en-vs-kondensator-0805-29199814.pdf?src-supplier=Conrad
J2 = Connector 3 Pin
JP1 = JP2: WR-PHD 2.54 mm Angled Socket Header; Manufacturer: W¨¹rth Elektronik eiSos GmbH; partNo: 613002143121; ComponentLink1 Description: Manufacturer; ComponentLink2 Description: Datasheet; NoPins: 02; Created Date: 29 March 2013; ComponentLink1URL: http://www.we-online.com; ComponentLink2URL: http://katalog.we-online.de/em/datasheet/6130xx143121.pdf; Created by: Karrer Zheng
R25 = Resistor: as R2 on sheet 2_DS3231; Supplier 1: Future Electronics; Supplier Part Number 1: 3310877; RoHS: Yes; Category: Chip SMD Resistors; Stock 1: 3290000; Pricing 1: 5000=0.0035, 25000=0.0034, 100000=0.0032, 250000=0.0032, 625000=0.003 (USD); Case/Package: 0805; Case Code (Imperial): 0805; Case Code (Metric): 2012; Size Code: 0805; Min Operating Temperature: -55°C; Max Operating Temperature: 155°C; Tolerance: 1%; Packaging: Tape and Reel; Resistor Type: Thick Film; Package Quantity: 1; Termination: SMD/SMT; Number of Terminations: 2; Max Power Dissipation: 125mW; Features: Moisture Resistant; Series: RC; Construction: Rectangular; Resistance Tolerance: 1%; Technology: THICK FILM; Length: 0.079inch; Width: 0.049inch; Height: 0.024inch; Depth: 1.25mm; Reach SVHC Compliant: Unknown; Lead Free: Lead Free; Military Standard: Not; RoHS Compliant: Yes
U3 = ESP-WROOM-32: Transceptor serie ESP-WROOM-32; Placa de evaluaciÃ³n 802.11 b/g/n (Wi-Fi, WiFi, WLAN), BluetoothÂ® Smart 4.x de bajo consumo (BLE); MF: Espressif Systems; SnapEDA_Link: https://www.snapeda.com/parts/ESP-WROOM-32/Espressif+Systems/view-part/?ref=snap; Package: Module Espressif Systems; Value: *; MP: ESP-WROOM-32; Check_prices: https://www.snapeda.com/parts/ESP-WROOM-32/Espressif+Systems/view-part/?ref=eda

## Sheet 5_LCD.SchDoc
size A; SheetNumber: 5; SheetTotal: 5
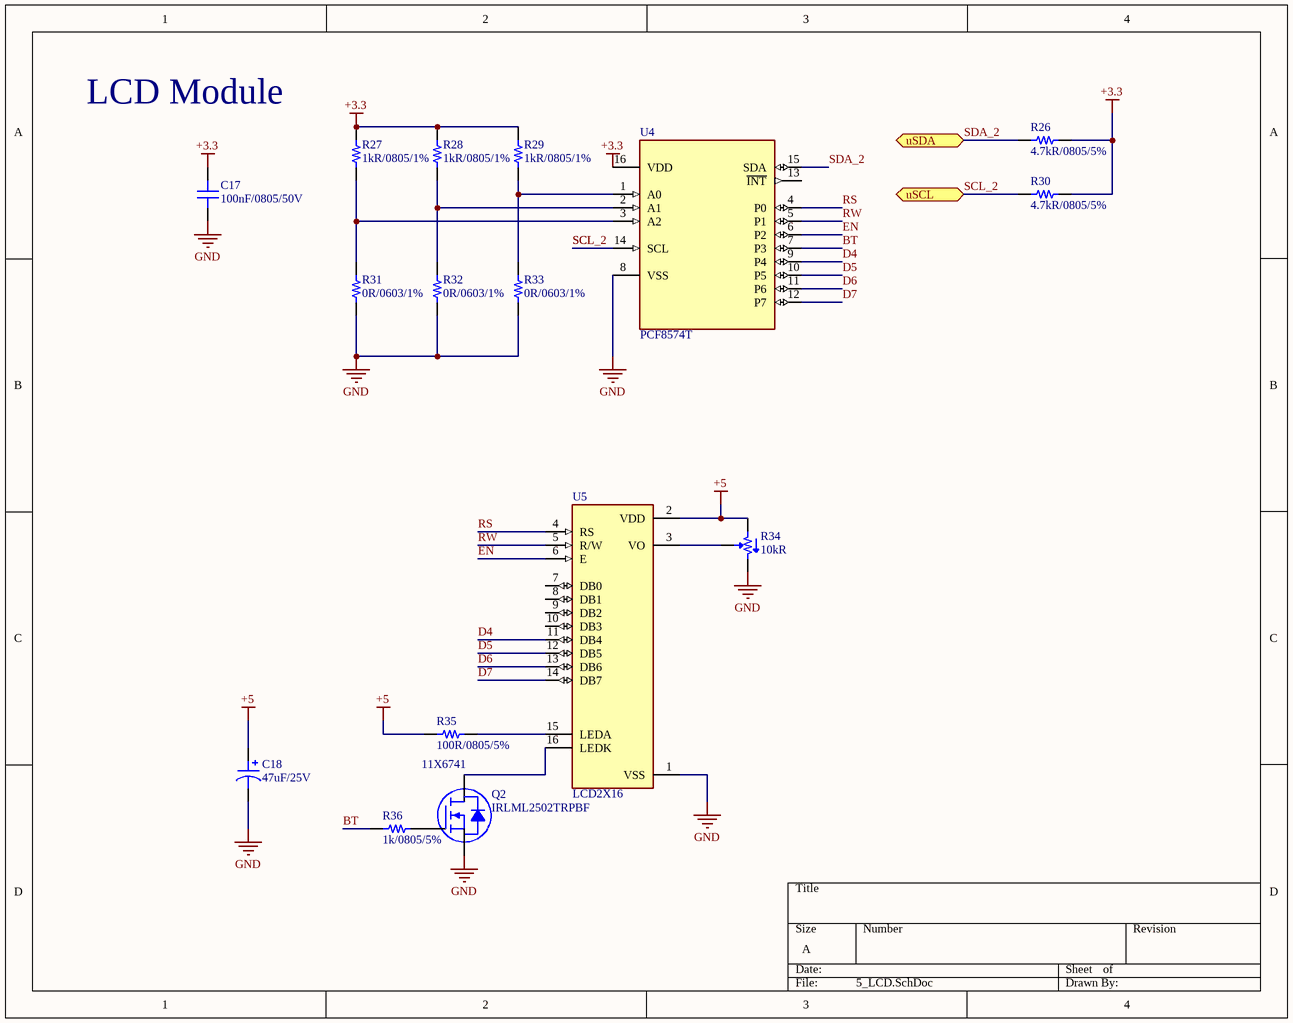
[diagram p4: 5_LCD.SchDoc]

### Parts
C17  100nF/0805/50V  [CAP FILM 0805]
C18  47uF/25V  [CAP ALSMD 6.6MM H5.4MM]
Q2  IRLML2502TRPBF  Supplier Part Number 1: 11X6741  [TI SOT-23-3 DBZ]
R26  4.7kR/0805/5%  [RES 0805_2012]
R27  1kR/0805/1%  [RES 0805_2012]
R28  1kR/0805/1%  [RES 0805_2012]
R29  1kR/0805/1%  [RES 0805_2012]
R30  4.7kR/0805/5%  [RES 0805_2012]
R31  0R/0603/1%  [RES 0603_1608]
R32  0R/0603/1%  [RES 0603_1608]
R33  0R/0603/1%  [RES 0603_1608]
R34  10kR  [POT Panasonic EVM]
R35  100R/0805/5%  [RES 0805_2012]
R36  1k/0805/5%  [RES 0805_2012]
U4  PCF8574T  [SOIC127P1032X265-16N]
U5  LCD2X16  [LCD_LCD2X16]

### Ports
uSCL (bidir), uSDA (bidir)

### Nets
+3.3: C17.2 R26.2 R27.2 R28.2 R29.2 R30.2 U4.16(VDD)
+5: C18.1 R34.1 R35.1 U5.2(VDD)
GND: C17.1 C18.2 Q2.2(S) R31.1 R32.1 R33.1 R34.3 U4.8(VSS) U5.1(VSS)
BT: R36.2 U4.7(P3)
D4: U4.9(P4) U5.11(DB4)
D5: U4.10(P5) U5.12(DB5)
D6: U4.11(P6) U5.13(DB6)
D7: U4.12(P7) U5.14(DB7)
EN: U4.6(P2) U5.6(E)
RS: U4.4(P0) U5.4(RS)
RW: U4.5(P1) U5.5(R/W)
SCL: R30.1 U4.14(SCL) ; port uSCL  [also labelled SCL_2]
SDA_2: R26.1 U4.15(SDA) ; port uSDA  [project net SDA_1]
NetQ2_1: Q2.1(G) R36.1
NetQ2_3: Q2.3(D) U5.16(LEDK)
NetR27_1: R27.1 R31.2 U4.3(A2)
NetR28_1: R28.1 R32.2 U4.2(A1)
NetR29_1: R29.1 R33.2 U4.1(A0)
NetR34_2: R34.2 U5.3(VO)
NetR35_2: R35.2 U5.15(LEDA)

Not connected (* = marked no-connect by the designer): U4 13(~{INT}); U5 7(DB0) 8(DB1) 9(DB2) 10(DB3)

### Notes on the sheet
- LCD Module

### Library data of the parts
C17 = Capacitor - MLCC: as C4 on sheet 1_Power_Supply; Supplier 1: Avnet; Supplier Part Number 1: CL21B104KBCNNNC; RoHS: Yes; Category: Ceramic Capacitors; Stock 1: 850000; Pricing 1: 4000=0.0097, 8000=0.00455, 16000=0.00444, 24000=0.00434, 32000=0.00423 (USD); Mount: Surface Mount; Case/Package: 0805; Case Code (Metric): 2012; Case Code (Imperial): 0805; Material: Ceramic; Min Operating Temperature: -55°C; Max Operating Temperature: 125°C; Tolerance: 10%; Dielectric: X7R; Packaging: Tape and Reel; Voltage: 50V; Series: CL; Construction: Flat; Voltage Rating (DC): 50V; Length: 2mm; Width: 0.049inch; Height: 0.85mm; Depth: 1.25mm; Thickness: 0.037inch; Radiation Hardening: No; RoHS Compliant: Yes; Lead Free: 5697LeadFree; ComponentLink1URL: https://datasheet.ciiva.com/25710/cl21b104kbcnnnc-25710182.pdf?src-supplier=Digikey; ComponentLink1Description: https://datasheet.ciiva.com/25710/cl21b104kbcnnnc-25710182.pdf?src-supplier=Digikey; ComponentLink2URL: https://datasheet.ciiva.com/29199/454152-da-01-en-vs-kondensator-0805-29199814.pdf?src-supplier=Conrad; ComponentLink2Description: https://datasheet.ciiva.com/29199/454152-da-01-en-vs-kondensator-0805-29199814.pdf?src-supplier=Conrad
C18 = Capacitor - Aluminum: SMT Polarised Capacitor
Q2 = MOSFET N-CH: Mosfet, Power; N-ch; Vdss 20V; Rds(on) 0.035 Ohm; Id 4.2A; MICRO3; Pd 1.25W; Vgs +/-12V; Manufacturer: International Rectifier; Nominal Vgs: 1.2V; Drain-source On Resistance-Max: 45mR; Supplier 1: Newark; Manufacturer Part Number: IRLML2502TRPBF; RoHS: Yes; Category: Uncategorized; Case/Package: SOT-23; Number of Pins: 3; Min Operating Temperature: -55°C; Max Operating Temperature: 150°C; Drain to Source Voltage (Vdss): 20V; Continuous Drain Current (ID): 4.2A; Voltage Rating (DC): 20V; Current Rating: 4.2A; Dual Supply Voltage: 20V; Threshold Voltage: 1.2V; Termination: SMD/SMT; Max Power Dissipation: 1.25W; RoHS Compliant: Yes; Lead Free: Lead Free; Reach SVHC Compliant: No; ComponentLink1URL: https://datasheet.ciiva.com/36526/1563649-36526014.pdf?src-supplier=Jameco; ComponentLink1Description: https://datasheet.ciiva.com/36526/1563649-36526014.pdf?src-supplier=Jameco; ComponentLink2URL: https://datasheet.ciiva.com/16425/irlml2502pbf-16425943.pdf?src-supplier=Future+Electronics; ComponentLink2Description: https://datasheet.ciiva.com/16425/irlml2502pbf-16425943.pdf?src-supplier=Future+Electronics; ComponentLink3URL: https://datasheet.ciiva.com/6156/irlml2502-6156070.pdf?src-supplier=Farnell; ComponentLink3Description: https://datasheet.ciiva.com/6156/irlml2502-6156070.pdf?src-supplier=Farnell; ComponentLink4URL: https://datasheet.ciiva.com/7935/irlml2502-7935685.pdf?src-supplier=Element14; ComponentLink4Description: https://datasheet.ciiva.com/7935/irlml2502-7935685.pdf?src-supplier=Element14
R26 R30 = Resistor: SMD Chip Resistor, 4.7 kOhm, ± 5%, 125 mW, 0805 [2012 Metric], Thick Film, General Purpose; Manufacturer: Vishay Dale; Manufacturer Part Number: CRCW08054K70JNEA; Resistance: 4.7kR; Power Rating: 125mW; Voltage Rating: 150V; Temperature Coefficient: 200ppm/°C; Supplier 1: Mouser; Supplier Part Number 1: 71-CRCW0805J-4.7K-E3; RoHS: Yes; Category: Chip SMD Resistors; Stock 1: 11837; Pricing 1: 1=0.1, 10=0.022, 50=0.022, 100=0.015, 1000=0.012, 10000=0.005 (USD); Case/Package: 0805; Weight: 0.000194oz; Case Code (Imperial): 0805; Case Code (Metric): 2012; Contact Plating: Tin; Size Code: 0805; Min Operating Temperature: -55°C; Max Operating Temperature: 155°C; Packaging: Tape and Reel; Tolerance: 5%; Package Quantity: 5000; Termination: SMD/SMT; Features: Automotive AEC-Q200; Series: CRCW; Max Power Dissipation: 125mW; Number of Terminations: 2; Resistor Type: Thick Film; Construction: Rectangular; Resistance Tolerance: 5%; Technology: THICK FILM; Length: 2mm; Width: 1.25mm; Height: 0.45mm; Depth: 1.25mm; Radiation Hardening: No; RoHS Compliant: Yes; Lead Free: 5697LeadFree; Military Standard: Not; Reach SVHC Compliant: Unknown; ComponentLink1URL: https://datasheet.ciiva.com/28606/1912744-28606777.pdf?src-supplier=Element14; ComponentLink1Description: https://datasheet.ciiva.com/28606/1912744-28606777.pdf?src-supplier=Element14; ComponentLink2URL: https://datasheet.ciiva.com/9071/dcrcwe3-9071273.pdf?src-supplier=Avnet; ComponentLink2Description: https://datasheet.ciiva.com/9071/dcrcwe3-9071273.pdf?src-supplier=Avnet; ComponentLink3URL: https://datasheet.ciiva.com/16786/70201119-16786966.pdf?src-supplier=Allied+Electronics; ComponentLink3Description: https://datasheet.ciiva.com/16786/70201119-16786966.pdf?src-supplier=Allied+Electronics
R27-R29 = Resistor: SMD Chip Resistor, 1 kOhm, ï¿½ 1%, 125 mW, 0805 [2012 Metric], Thick Film, General Purpose; Manufacturer: Yageo; Manufacturer Part Number: RC0805FR-071KL; Resistance: 1kR; Voltage Rating (DC): 150V; Temperature Coefficient: 100ppm/°C; Power Rating: 125mW; Supplier 1: Future Electronics; Supplier Part Number 1: 8126013; RoHS: Yes; Category: Chip SMD Resistors; Stock 1: 1010000; Pricing 1: 5000=0.0032, 25000=0.003, 100000=0.0029, 250000=0.0028, 625000=0.0027 (USD); Case/Package: 0805; Number of Pins: 2; Case Code (Metric): 2012; Case Code (Imperial): 0805; Size Code: 0805; Min Operating Temperature: -55°C; Max Operating Temperature: 155°C; Tolerance: 1%; Packaging: Tape and Reel; Resistor Type: Thick Film; Package Quantity: 1; Voltage Rating: 150V; Termination: SMD/SMT; Series: RC; Number of Terminations: 2; Max Power Dissipation: 125mW; Features: Moisture Resistant; Resistance Tolerance: 1%; Construction: Rectangular; Voltage Rating (AC): 150V; Length: 0.079inch; Width: 0.049inch; Height: 0.024inch; Depth: 1.25mm; Reach SVHC Compliant: No; RoHS Compliant: Yes; Lead Free: 5697LeadFree; Military Standard: Not; ComponentLink1URL: https://datasheet.ciiva.com/7941/1686128-7941719.pdf?src-supplier=Element14; ComponentLink1Description: https://datasheet.ciiva.com/7941/1686128-7941719.pdf?src-supplier=Element14; ComponentLink2URL: https://datasheet.ciiva.com/46385/444164-46385020.pdf?src-supplier=Element14; ComponentLink2Description: https://datasheet.ciiva.com/46385/444164-46385020.pdf?src-supplier=Element14; ComponentLink3URL: https://datasheet.ciiva.com/2456/pyu-r-int-thick-7-2456976.pdf?src-supplier=Digikey; ComponentLink3Description: https://datasheet.ciiva.com/2456/pyu-r-int-thick-7-2456976.pdf?src-supplier=Digikey; ComponentLink4URL: https://datasheet.ciiva.com/2456/pyu-r-int-thick-7-2456977.pdf?src-supplier=Digikey; ComponentLink4Description: https://datasheet.ciiva.com/2456/pyu-r-int-thick-7-2456977.pdf?src-supplier=Digikey; ComponentLink5URL: https://datasheet.ciiva.com/2456/pyu-r-int-thick-7-2456975.pdf?src-supplier=Digikey; ComponentLink5Description: https://datasheet.ciiva.com/2456/pyu-r-int-thick-7-2456975.pdf?src-supplier=Digikey; ComponentLink6URL: https://datasheet.ciiva.com/16850/rc0805-16850409.pdf?src-supplier=Future+Electronics; ComponentLink6Description: https://datasheet.ciiva.com/16850/rc0805-16850409.pdf?src-supplier=Future+Electronics
R31-R33 = Resistor: SMD Chip Resistor, 1 kOhm, ï¿½ 1%, 125 mW, 0805 [2012 Metric], Thick Film, General Purpose; Manufacturer: Yageo; Manufacturer Part Number: RC0805FR-071KL; Resistance: 0R; Voltage Rating (DC): 150V; Temperature Coefficient: 100ppm/°C; Power Rating: 125mW; Supplier 1: Future Electronics; Supplier Part Number 1: 8126013; RoHS: Yes; Category: Chip SMD Resistors; Stock 1: 1010000; Pricing 1: 5000=0.0032, 25000=0.003, 100000=0.0029, 250000=0.0028, 625000=0.0027 (USD); Case/Package: 0603; Number of Pins: 2; Case Code (Metric): 2012; Case Code (Imperial): 0805; Size Code: 0805; Min Operating Temperature: -55°C; Max Operating Temperature: 155°C; Tolerance: 1%; Packaging: Tape and Reel; Resistor Type: Thick Film; Package Quantity: 1; Voltage Rating: 150V; Termination: SMD/SMT; Series: RC; Number of Terminations: 2; Max Power Dissipation: 125mW; Features: Moisture Resistant; Resistance Tolerance: 1%; Construction: Rectangular; Voltage Rating (AC): 150V; Length: 0.079inch; Width: 0.049inch; Height: 0.024inch; Depth: 1.25mm; Reach SVHC Compliant: No; RoHS Compliant: Yes; Lead Free: 5697LeadFree; Military Standard: Not; ComponentLink1URL: https://datasheet.ciiva.com/7941/1686128-7941719.pdf?src-supplier=Element14; ComponentLink1Description: https://datasheet.ciiva.com/7941/1686128-7941719.pdf?src-supplier=Element14; ComponentLink2URL: https://datasheet.ciiva.com/46385/444164-46385020.pdf?src-supplier=Element14; ComponentLink2Description: https://datasheet.ciiva.com/46385/444164-46385020.pdf?src-supplier=Element14; ComponentLink3URL: https://datasheet.ciiva.com/2456/pyu-r-int-thick-7-2456976.pdf?src-supplier=Digikey; ComponentLink3Description: https://datasheet.ciiva.com/2456/pyu-r-int-thick-7-2456976.pdf?src-supplier=Digikey; ComponentLink4URL: https://datasheet.ciiva.com/2456/pyu-r-int-thick-7-2456977.pdf?src-supplier=Digikey; ComponentLink4Description: https://datasheet.ciiva.com/2456/pyu-r-int-thick-7-2456977.pdf?src-supplier=Digikey; ComponentLink5URL: https://datasheet.ciiva.com/2456/pyu-r-int-thick-7-2456975.pdf?src-supplier=Digikey; ComponentLink5Description: https://datasheet.ciiva.com/2456/pyu-r-int-thick-7-2456975.pdf?src-supplier=Digikey; ComponentLink6URL: https://datasheet.ciiva.com/16850/rc0805-16850409.pdf?src-supplier=Future+Electronics; ComponentLink6Description: https://datasheet.ciiva.com/16850/rc0805-16850409.pdf?src-supplier=Future+Electronics
R34 = Potentiometer: Res Cermet Trimmer 10K Ohm 25% 3/20W 1Turn Foot Print SMD Carrier T/R; Manufacturer: Panasonic; Manufacturer Part Number: EVM-2WSX80B14; Power Rating: 150mW; Voltage Rating: 50V; Number of Turns: 1; Temperature Coefficient: 250ppm/°C; Supplier 1: Farnell; Supplier Part Number 1: 1849772RL; RoHS: Yes; Category: Variable Resistors and Potentiometers; Pricing 1: 3000=0.172 (GBP); Mount: Surface Mount; Color: Silver; Min Operating Temperature: -40°C; Max Operating Temperature: 100°C; Resistance: 10kR; Tolerance: 25%; Packaging: Tape and Reel; Package Quantity: 1; Resistor Type: Cermet; Termination: SMD/SMT; Taper: Linear; Max Power Dissipation: 150mW; Series: EVM; Resistance Tolerance: 25%; Technology: CERMET; Length: 2.75mm; Width: 2.2mm; Height: 1.05mm; Depth: 2.75mm; Radiation Hardening: No; Lead Free: Lead Free; RoHS Compliant: Yes; ComponentLink1URL: https://datasheet.ciiva.com/11833/0900766b80f7f9dc-11833154.pdf?src-supplier=Rs; ComponentLink1Description: https://datasheet.ciiva.com/11833/0900766b80f7f9dc-11833154.pdf?src-supplier=Rs; ComponentLink2URL: https://datasheet.ciiva.com/7655/730973-7655221.pdf?src-supplier=Element14; ComponentLink2Description: https://datasheet.ciiva.com/7655/730973-7655221.pdf?src-supplier=Element14; ComponentLink3URL: https://datasheet.ciiva.com/8096/aoi0000ce1-8096841.pdf?src-supplier=Avnet; ComponentLink3Description: https://datasheet.ciiva.com/8096/aoi0000ce1-8096841.pdf?src-supplier=Avnet; ComponentLink4URL: https://datasheet.ciiva.com/2155/aoi0000ce1-2155668.pdf?src-supplier=Digikey; ComponentLink4Description: https://datasheet.ciiva.com/2155/aoi0000ce1-2155668.pdf?src-supplier=Digikey; ComponentLink5URL: https://datasheet.ciiva.com/2155/aoi0000ce1-2155669.pdf?src-supplier=Digikey; ComponentLink5Description: https://datasheet.ciiva.com/2155/aoi0000ce1-2155669.pdf?src-supplier=Digikey; ComponentLink6URL: https://datasheet.ciiva.com/2155/aoi0000ce1-2155667.pdf?src-supplier=Digikey; ComponentLink6Description: https://datasheet.ciiva.com/2155/aoi0000ce1-2155667.pdf?src-supplier=Digikey
R35 = Resistor: as R6 on sheet 3_IO_Module; Supplier 1: Future Electronics; Supplier Part Number 1: 4083153; RoHS: Yes; Category: Chip SMD Resistors; Stock 1: 295000; Pricing 1: 5000=0.004, 25000=0.0038, 100000=0.0037, 250000=0.0036, 625000=0.0034 (USD); ComponentLink1URL: http://www.mouser.com/ds/2/447/yageodocoutput-1111992.pdf?src-supplier=Mouser; ComponentLink1Description: http://www.mouser.com/ds/2/447/yageodocoutput-1111992.pdf?src-supplier=Mouser; ComponentLink2URL: https://www.yageo.com/upload/media/product/productsearch/datasheet/rchip/PYu-AC_51_RoHS_L_7.pdf?src-supplier=Digikey; ComponentLink2Description: https://www.yageo.com/upload/media/product/productsearch/datasheet/rchip/PYu-AC_51_RoHS_L_7.pdf?src-supplier=Digikey; ComponentLink3URL: http://www.yageo.com/NewPortal/yageodocoutput?fileName=/pdf/R-Chip/PYu-AC_51_RoHS_L_6.pdf&src-supplier=Digikey; ComponentLink3Description: http://www.yageo.com/NewPortal/yageodocoutput?fileName=/pdf/R-Chip/PYu-AC_51_RoHS_L_6.pdf&src-supplier=Digikey; ComponentLink4URL: https://datasheet.octopart.com/AC0805JR-07100RL-Yageo-datasheet-151884373.pdf?src-supplier=Future+Electronics; ComponentLink4Description: https://datasheet.octopart.com/AC0805JR-07100RL-Yageo-datasheet-151884373.pdf?src-supplier=Future+Electronics; Case/Package: 0805; Tolerance: 5%
R36 = Resistor: Res Thin Film 0805 2K Ohm 0.1% 0.125W(1/8W) ±25ppm/C Pad SMD T/R; Manufacturer: Yageo; Manufacturer Part Number: RT0805BRD072KL; Voltage Rating (DC): 150V; Resistance: 1k; Tolerance: 5%; Supplier 1: Future Electronics; Supplier Part Number 1: 9309717; RoHS: Yes; Category: Chip SMD Resistors; Stock 1: 35000; Pricing 1: 5000=0.0215, 15000=0.0207, 25000=0.0203, 75000=0.0196, 125000=0.019 (USD); Lead Free: 5697LeadFree; ComponentLink1URL: https://datasheet.ciiva.com/12836/pyu-rt-1-to-0-05-rohs-l-4-12836431.pdf?src-supplier=Mouser; ComponentLink1Description: https://datasheet.ciiva.com/12836/pyu-rt-1-to-0-05-rohs-l-4-12836431.pdf?src-supplier=Mouser; ComponentLink2URL: https://datasheet.ciiva.com/8894/pyu-rt-1-to-0-05-rohs-l-4-8894822.pdf?src-supplier=Avnet; ComponentLink2Description: https://datasheet.ciiva.com/8894/pyu-rt-1-to-0-05-rohs-l-4-8894822.pdf?src-supplier=Avnet; ComponentLink3URL: https://datasheet.ciiva.com/2584/pyu-rt-1-to-0-05-rohs-l-4-2584929.pdf?src-supplier=Digikey; ComponentLink3Description: https://datasheet.ciiva.com/2584/pyu-rt-1-to-0-05-rohs-l-4-2584929.pdf?src-supplier=Digikey; ComponentLink4URL: https://datasheet.ciiva.com/46634/pyu-rt-1-to-0-05-rohs-l-5-46634903.pdf?src-supplier=Digikey; ComponentLink4Description: https://datasheet.ciiva.com/46634/pyu-rt-1-to-0-05-rohs-l-5-46634903.pdf?src-supplier=Digikey; Case/Package: 0805
U4 = PCF8574T: I/O Expander 8 IÂ²C 100 kHz 20-SSOP; MF: NXP Semiconductors; MP: PCF8574T; Price: None; Availability: In Stock; Package: SOIC-16 NXP Semiconductors; Purchase-URL: https://pricing.snapeda.com/search/part/PCF8574T/?ref=eda; SnapEDA_Link: https://www.snapeda.com/parts/PCF8574T/NXP+Semiconductors/view-part/?ref=snap; Value: *; Check_prices: https://www.snapeda.com/parts/PCF8574T/NXP+Semiconductors/view-part/?ref=eda
U5 = LCD2X16: Display; Display: LCD 2x16 characters (blue backlight); Price: None; Value: *; MP: LCD2X16; Package: None; Availability: Unavailable

## Nets that join several sheets
+3.3: 1_Power_Supply (C1.1 IC1.2 IC1.4), 2_DS3231 (6 pins), 3_IO_Module (8 pins), 4_MCU (C14.2 C15.2 R25.2 U3.2), 5_LCD (7 pins)
+5: 1_Power_Supply (7 pins), 3_IO_Module (D2.2 LS1.P), 5_LCD (C18.1 R34.1 R35.1 U5.2)
GND: 1_Power_Supply (13 pins), 2_DS3231 (12 pins), 3_IO_Module (15 pins), 4_MCU (9 pins), 5_LCD (9 pins)
SCL: 2_DS3231 (R4.2 U1.16), 4_MCU (U3.36), 5_LCD (R30.1 U4.14)
SDA_1: 2_DS3231 (R5.2 U1.15), 4_MCU (U3.33), 5_LCD (R26.1 U4.15)
uBTN_1: 3_IO_Module (R6.2), 4_MCU (U3.37)
uBTN_2: 3_IO_Module (R7.2), 4_MCU (U3.10)
uBTN_3: 3_IO_Module (R8.2), 4_MCU (U3.11)
uBTN_4: 3_IO_Module (R9.2), 4_MCU (U3.12)
uBTN_5: 3_IO_Module (R10.2), 4_MCU (U3.8)
uBTN_6: 3_IO_Module (R12.2), 4_MCU (U3.9)
uBuzzer: 3_IO_Module (R11.2), 4_MCU (U3.30)